# Altium schematic sheet temp_controller_01.SchDoc
size A; SheetNumber: 1; SheetTotal: 1
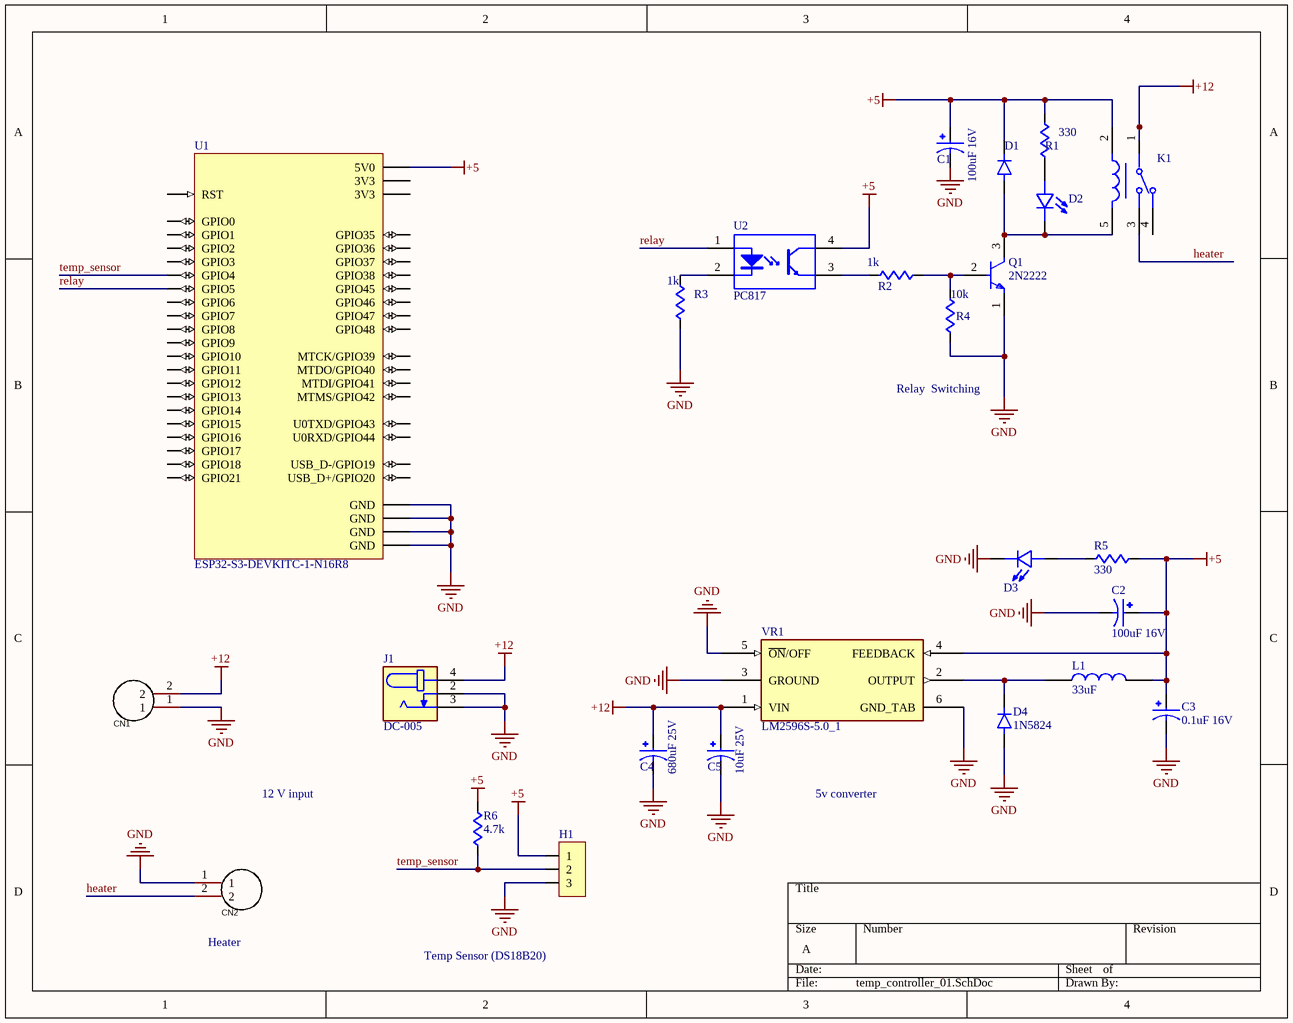
[diagram p0: temp_controller_01.SchDoc]

## Parts
C1  100uF 16V  [100uF  16V]
C2  100uF 16V  [100uF  16V]
C3  0.1uF 16V  [0.1uF 16V]
C4  680uF 25V  [680uF 25V]
C5  10uF 25V  [10 uF 25V]
CN1  WJ2EDGRC-5.08-2P  [Terminal Block P5.08-2P]  (value not drawn)
CN2  WJ2EDGRC-5.08-2P  [Terminal Block P5.08-2P]  (value not drawn)
D1  1N4007-T  [DIOAD780W78L463D236]  (value not drawn)
D2  L08R5000Q1  [LEDRD254W57D500H1070]  (value not drawn)
D3  L08R5000Q1  [LEDRD254W57D500H1070]  (value not drawn)
D4  1N5824  [DIOAD1898W129L762D1143]
H1  Header 1x3  [Header 1x3 male]  (value not drawn)
J1  DC-005  [NINIGI_DC-005]
K1  G5LE-14-DC5  [FP-G5LE-14-DC5-MFG]  (value not drawn)
L1  33uF  [33uF TH  Radial]
Q1  2N2222  [FP-JAN2N2222A-MFG]
R1  330  [RESA60-630X240]
R2  1k  [RESA60-630X240]
R3  1k  [RESA60-630X240]
R4  10k  [RESA60-630X240]
R5  330  [RESA60-630X240]
R6  4.7k  [RESA60-630X240]
U1  ESP32-S3-DEVKITC-1-N16R8  [XCVR_ESP32-S3-DEVKITC-1-N8R2]
U2  PC817  [LTST-LTV-817-4]
VR1  LM2596S-5.0_1  [TO170P1524X483-6N]

## Nets
+5: C1.P C2.P C3.P D1.K H1.1 K1.2 L1.2 R1.1 R5.2 R6.1 U1.J1_21(5V0) U2.4(COLLECTOR) VR1.4(FEEDBACK)
+12: C4.P C5.P CN1.2 J1.4 K1.1 VR1.1(VIN)
GND: C1.N C2.N C3.N C4.N C5.N CN1.1 CN2.1 D3.C D4.A H1.3 J1.2 J1.3 Q1.1(E) R3.2 R4.2 U1.J1_22(GND) U1.J3_1(GND) U1.J3_21(GND) U1.J3_22(GND) VR1.3(GROUND) VR1.5(~{ON}/OFF) VR1.6(GND_TAB)
heater: CN2.2 K1.3
relay: U1.J1_5(GPIO5) U2.1(ANODE)
temp_sensor: H1.2 R6.2 U1.J1_4(GPIO4)
NetD1_A: D1.A D2.C K1.5 Q1.3(C)
NetD2_A: D2.A R1.2
NetD3_A: D3.A R5.1
NetD4_C: D4.C(K) L1.1 VR1.2(OUTPUT)
NetQ1_2: Q1.2(B) R2.1 R4.1
NetR2_2: R2.2 U2.3(EMITTER)
NetR3_1: R3.1 U2.2(CATHODE)

Not connected (* = marked no-connect by the designer): K1 4; U1 J1_1(3V3) J1_2(3V3) J1_3(RST) J1_6(GPIO6) J1_7(GPIO7) J1_8(GPIO15) J1_9(GPIO16) J1_10(GPIO17) J1_11(GPIO18) J1_12(GPIO8) J1_13(GPIO3) J1_14(GPIO46) J1_15(GPIO9) J1_16(GPIO10) J1_17(GPIO11) J1_18(GPIO12) J1_19(GPIO13) J1_20(GPIO14) J3_2(U0TXD/GPIO43) J3_3(U0RXD/GPIO44) J3_4(GPIO1) J3_5(GPIO2) J3_6(MTMS/GPIO42) J3_7(MTDI/GPIO41) J3_8(MTDO/GPIO40) J3_9(MTCK/GPIO39) J3_10(GPIO38) J3_11(GPIO37) J3_12(GPIO36) J3_13(GPIO35) J3_14(GPIO0) J3_15(GPIO45) J3_16(GPIO48) J3_17(GPIO47) J3_18(GPIO21) J3_19(USB_D+/GPIO20) J3_20(USB_D-/GPIO19)

## Notes on the sheet
- (near R4) Relay  Switching
- 12 V input
- 5v converter
- (near CN2) Heater
- Temp Sensor (DS18B20)

## Library data of the parts
C1 C2 = 100uF 16V: CAP ALUM 100uF 16V RADIAL TH; MP: EEU-FR1E221B; MF: Panasonic Electronic Components; Package: RADIAL-2 Panasonic; Availability: In Stock; Value: *; SnapEDA_Link: https://www.snapeda.com/parts/EEU-FR1E221B/Panasonic/view-part/?ref=snap; Price: None; Check_prices: https://www.snapeda.com/parts/EEU-FR1E221B/Panasonic/view-part/?ref=eda; Purchase-URL: https://pricing.snapeda.com/search/part/EEU-FR1E221B/?ref=eda
C3 = 0.1uF 16V: Cap 0.1uF 16VRADIAL TH; MP: EEU-FR1E221B; MF: Panasonic Electronic Components; Package: RADIAL-2 Panasonic; Availability: In Stock; Value: *; SnapEDA_Link: https://www.snapeda.com/parts/EEU-FR1E221B/Panasonic/view-part/?ref=snap; Price: None; Check_prices: https://www.snapeda.com/parts/EEU-FR1E221B/Panasonic/view-part/?ref=eda; Purchase-URL: https://pricing.snapeda.com/search/part/EEU-FR1E221B/?ref=eda
C4 = 680uF 25V: Cap 680uF 25V RADIAL TH; MP: EEU-FR1E221B; MF: Panasonic Electronic Components; Package: RADIAL-2 Panasonic; Availability: In Stock; Value: *; SnapEDA_Link: https://www.snapeda.com/parts/EEU-FR1E221B/Panasonic/view-part/?ref=snap; Price: None; Check_prices: https://www.snapeda.com/parts/EEU-FR1E221B/Panasonic/view-part/?ref=eda; Purchase-URL: https://pricing.snapeda.com/search/part/EEU-FR1E221B/?ref=eda
C5 = 10uF 25V: Cap 10uF 25V RADIAL TH; MP: EEU-FR1E221B; MF: Panasonic Electronic Components; Package: RADIAL-2 Panasonic; Availability: In Stock; Value: *; SnapEDA_Link: https://www.snapeda.com/parts/EEU-FR1E221B/Panasonic/view-part/?ref=snap; Price: None; Check_prices: https://www.snapeda.com/parts/EEU-FR1E221B/Panasonic/view-part/?ref=eda; Purchase-URL: https://pricing.snapeda.com/search/part/EEU-FR1E221B/?ref=eda
CN1 CN2 = WJ2EDGRC-5.08-2P: Manufacturer: KANGNEX(康奈克斯电气); Add into BOM: yes; Connector Type: 板端/Receptacle-Close; Structure: 1x2P; Pitch: 5.08mm; Number of PINs Per Row: 2; Symbol: WJ2EDGRC-5.08-2P; Device: WJ2EDGRC-5.08-2P; Supplier: LCSC; Manufacturer Part: WJ2EDGRC-5.08-2P; Supplier Part: C3697; JLCPCB Part Class: Extended Part; LCSC Part Name: 5.08mm 1x2P 排数:1 每排P数:2; Supplier Footprint: 弯插,P=5.08mm; Datasheet: https://atta.szlcsc.com/upload/public/pdf/source/20191225/C3697_6E7B45CD3FD3DA2CDF6A2CE707235E10.pdf; Convert to PCB: yes; Color: Green; Mounting Style: Bend; Number of Pins: 2P; Number of Rows: 1
D1 = 1N4007-T: Diode Standard 1A 1000V 1Vf DO41 | Diodes Inc 1N4007-T; MF: Diodes Incorporated; SnapEDA_Link: https://www.snapeda.com/parts/1N4007-T/Diodes+Inc./view-part/?ref=snap; Package: DO-41 Diodes Inc.; Value: *; MP: 1N4007-T; Check_prices: https://www.snapeda.com/parts/1N4007-T/Diodes+Inc./view-part/?ref=eda
D2 D3 = L08R5000Q1: LED, 5MM, ORANGE; LED / Lamp Size: 5mm / T-1 3/4; LED Colour: Orange; Typ Luminous Intensity: 4.3mcd; Viewing Angle: ...; MF: LED Technology; Value: *; SnapEDA_Link: https://www.snapeda.com/parts/L08R5000Q1/LED+Technology/view-part/?ref=snap; MP: L08R5000Q1; Check_prices: https://www.snapeda.com/parts/L08R5000Q1/LED+Technology/view-part/?ref=eda; Availability: In Stock; Price: None; Package: None
D4 = 1N5824: Diode Schottky 30V 5A Through Hole Axial; MF: Microsemi Corporation; Value: *; SnapEDA_Link: https://www.snapeda.com/parts/1N5824/Microsemi%20Corporation/view-part/49055/?ref=snap; MP: 1N5824; Availability: Unavailable; Price: None; Package: Axial Microsemi
J1 = DC-005: DC Jack; Availability: Unavailable; MP: DC-005; Value: *; Package: None; Price: None
K1 = CMP-08822-000008-1: RELAY GEN PURPOSE SPDT 10A 5V; Manufacturer: Omron; Number Of Contacts: 1; Coil Type: Non-Latching; Coil Current: 79.4mA; Coil Power: 400mW; Coil Resistance: 63Ω; Standoff Height: 0.5mm; Throw Configuration: SPDT; Ambient Temperature Range Low: -25°C; Package: 0; Device Class L2: Relays; Temperature Range High: +85°C; ComponentLink2Description: Datasheet; Octopart: https://octopart.com/g5le-14-dc5-omron-28829; Coil Voltage: 5V; Lead Free: Yes; Digikey Description: RELAY GEN PURPOSE SPDT 10A 5V; Device Class L1: Electromechanical; Device Class L3: Power Relays; ComponentLink2URL: https://omronfs.omron.com/en_US/ecb/products/pdf/en-g5le.pdf; Temperature: -25°C to +85°C; Ambient Temperature Range High: +85°C; RoHS: TRUE; Automotive: No; Height: 19mm; Category: Relay; Manufacturer Part Number: G5LE-14-DC5; Mouser Description: General Purpose Relays Power PCB Relay SPDT Sealed 5VDC; Current Rating: 10A; Switching Current: 10A; Temperature Range Low: -25°C
L1 = HCTI-33-11.7: Inductor | 33 uH | TH; MF: Signal Transformer; Mouser-Purchase-URL: https://snapeda.com/shop?store=Mouser&id=1645904; Availability: Bad; Price: None; Package: Radial Bel Fuse; MP: HCTI-33-11.7; Value: *; SnapEDA_Link: https://www.snapeda.com/parts/HCTI-33-11.7/Signal%20Transformer/view-part/1645904/?ref=snap; Arrow_Electronics-Purchase-URL: https://snapeda.com/shop?store=Arrow+Electronics&id=1645904
Q1 = CMP-06366-000013-1: TRANS NPN 50V 0.8A TO218
R1-R5 = CMP-1659-00075-1: Axial Resistor,; Tolerance: 1%; Voltage Rating: 250 V; Resistance: 1 kohm; Power Rating: 250 mW; ComponentLink2Description: Datasheet; RoHSCompliant: true; PackageReference: MFR-25; Case\Package: Axial; Max Operating Temperature: 155 degC; DatasheetVersion: Apr-13; ComponentLink1URL: http://www.yageo.com/; Length: 0.248 inch; ComponentLink2URL: http://www.yageo.com/documents/recent/Yageo%20LR_MFR_2013.pdf; Packaging: Bulk; Package Quantity: 200; PackageDescription: 2-Pin Axial Lead, Dia 2.4 mm, Body Length 6.3 mm; Min Operating Temperature: -55 degC; ComponentLink1Description: Manufacturer URL
R6 = CMP-1659-00075-1_1: Axial Resistor,; Tolerance: 1%; Voltage Rating: 250 V; Resistance: 1 kohm; Power Rating: 250 mW; ComponentLink2Description: Datasheet; RoHSCompliant: true; PackageReference: MFR-25; Case\Package: Axial; Max Operating Temperature: 155 degC; DatasheetVersion: Apr-13; ComponentLink1URL: http://www.yageo.com/; Length: 0.248 inch; ComponentLink2URL: http://www.yageo.com/documents/recent/Yageo%20LR_MFR_2013.pdf; Packaging: Bulk; Package Quantity: 200; PackageDescription: 2-Pin Axial Lead, Dia 2.4 mm, Body Length 6.3 mm; Min Operating Temperature: -55 degC; ComponentLink1Description: Manufacturer URL
U1 = ESP32-S3-DEVKITC-1-N8R2: WiFi Development Tools - 802.11 (Engineering Samples Only) ESP32-S3 General-Purpose Development Board, ESP32-S3-WROOM-1-N8R2, with Pin Header; MF: Espressif Systems; SnapEDA_Link: https://www.snapeda.com/parts/ESP32-S3-DEVKITC-1-N8R2/Espressif+Systems/view-part/?ref=snap; Package: None; Value: *; MP: ESP32-S3-DEVKITC-1-N8R2; Check_prices: https://www.snapeda.com/parts/ESP32-S3-DEVKITC-1-N8R2/Espressif+Systems/view-part/?ref=eda
U2 = CMP-2000-06632-1: Photocoupuler, 50 mA Forward Current, 1.2 V Forward Voltage, -50 to 110 degC, 4-Pin DIP, RoHS, Tube; Manufacturer: Lite-On; Maximum Fall Time: 18us; Maximum Collector Emitter Saturation Voltage: 200mV; Maximum Forward Voltage: 1.4V; Typical Rise Time: 4us; Maximum Collector Current: 50mA; Maximum Collector Emitter Voltage: 35V; Product Length: 4.6mm; Maximum Reverse Voltage: 6V; Minimum Isolation Voltage: 5000Vrms; Number of Channels per Chip: 1; Typical Fall Time: 3us; Product Width: 6.5mm; Minimum Current Transfer Ratio: 50%; Output Type: DC; Output Device: Transistor; Maximum Current Transfer Ratio: 600%; Pin_Count: 4; Product Height: 3.5mm; Maximum Power Dissipation: 200mW; Typical Forward Voltage: 1.2V; Package Reference: LTV-817; Datasheet URL: http://optoelectronics.liteon.com/upload/download/DS70-2012-0050/S_110_LTV-8X7%20series%200915.pdf; Family: LTV817; Package Description: 4-Pin Double In-line Package, Body 6.5 x 4.6 mm, Pitch 2.54 mm; Maximum Rise Time: 18us; Product Type: TransistorandPhotovoltaicOutputPhotoCouplers; Supplier_Package: PDIP; Mounting: ThroughHole; Minimum Operating Temperature: -30C; Manufacturer URL: http://www.us.liteon.com/; Datasheet Version: Rev. E, 10/2015; Mounting Technology: ThroughHole; Maximum Operating Temperature: 100C; Input Type: DC; Maximum Input Current: 50mA
VR1 = LM2596S-5.0_1: SIMPLE SWITCHER&reg; 4.5V to 40V, 3A Low Component Count Step-Down Regulator; MP: LM2596S-5.0/NOPB; MF: Texas Instruments; Price: None; Availability: In Stock; Package: TO-263-5 Texas Instruments; SnapEDA_Link: https://www.snapeda.com/parts/LM2596S-5.0/NOPB/Texas+Instruments/view-part/?ref=snap; Check_prices: https://www.snapeda.com/parts/LM2596S-5.0/NOPB/Texas+Instruments/view-part/?ref=eda; Value: *; Purchase-URL: https://pricing.snapeda.com/search/part/LM2596S-5.0/NOPB/?ref=eda